# EAGLE design BusPirate-v3b-schamp (EAGLE 5.10)
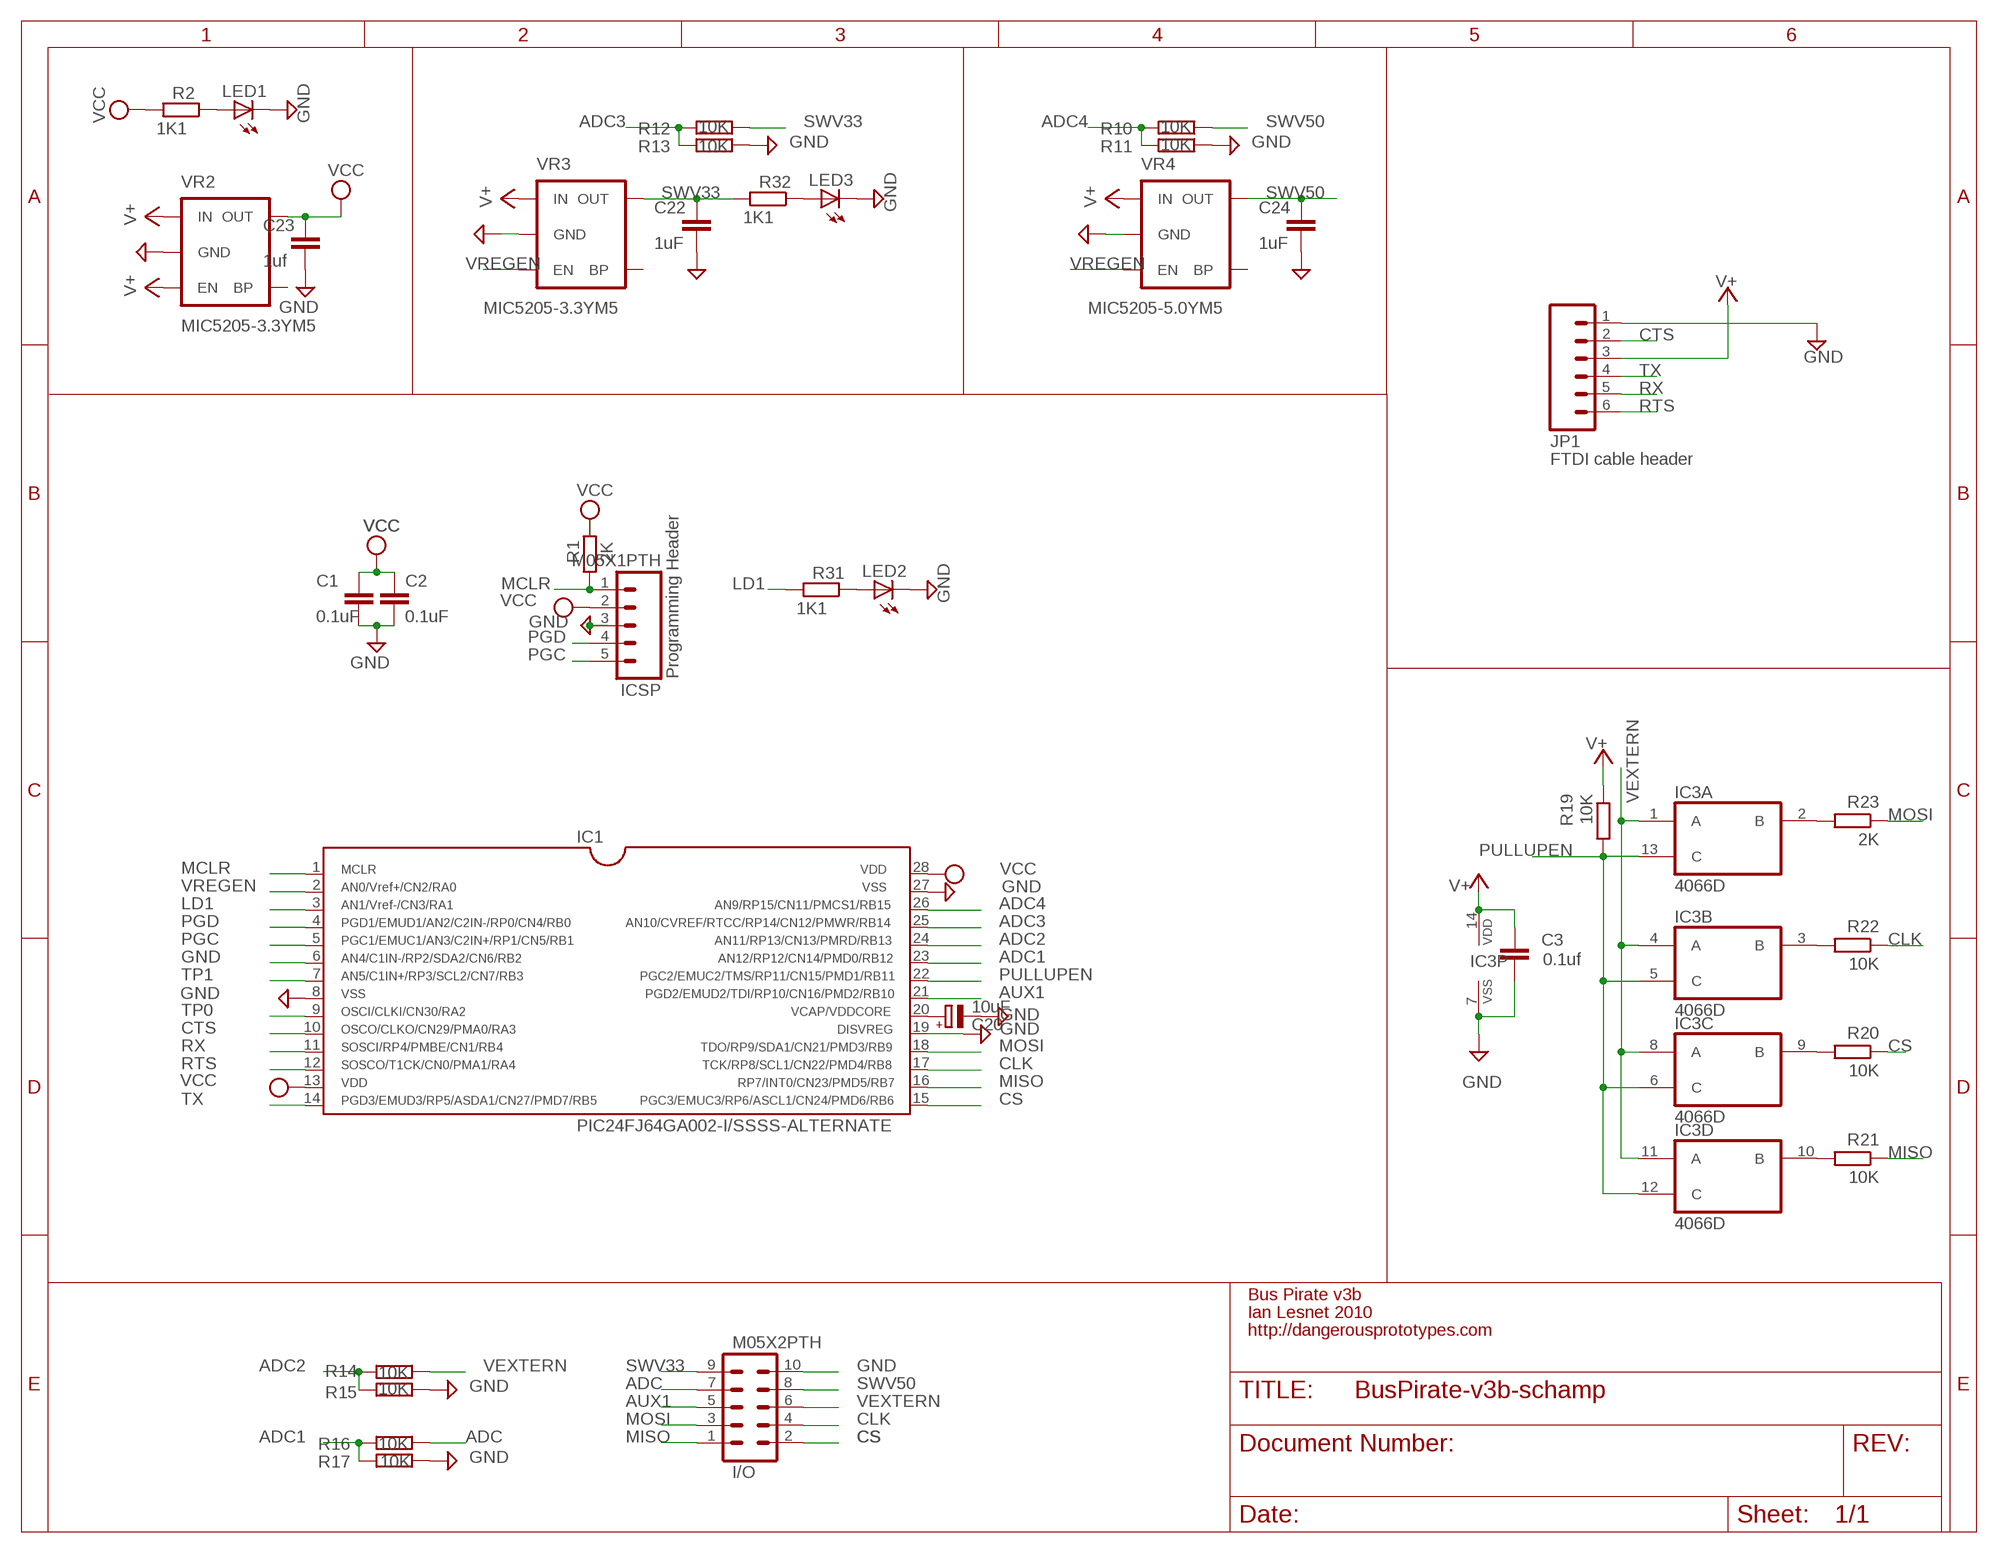
[diagram p0: schematic, sheet 1]

## Parts
C1  0.1uF  C-EUC0805  [C0805]
C2  0.1uF  C-EUC0805  [C0805]
C3  0.1uf  C-EUC0805  [C0805]
C20  10uF  CPOL-EUSMCA  [SMC_A]
C22  1uF  C-EUC0805  [C0805]
C23  1uf  C-EUC0805  [C0805]
C24  1uF  C-EUC0805  [C0805]
I/O  M05X2PTH  [AVR_ICSP]
IC1  PIC24FJ64GA002-I/SSSS-ALTERNATE  [SSOP28DB]
IC3  4066D  [SO14]
ICSP  M05X1PTH  M05LOCK_LONGPADS  [1X05_LOCK_LONGPADS]
JP1  M06LOCK_LONGPADS  [1X06_LOCK_LONGPADS]
LED1  LEDCHIP-LED0805  [CHIP-LED0805]
LED2  LEDCHIP-LED0805  [CHIP-LED0805]
LED3  LEDCHIP-LED0805  [CHIP-LED0805]
R1  2K  R-EU_R0805  [R0805]
R2  1K1  R-EU_M0805  [M0805]
R10  10K  R-EU_M0805  [M0805]
R11  10K  R-EU_M0805  [M0805]
R12  10K  R-EU_M0805  [M0805]
R13  10K  R-EU_M0805  [M0805]
R14  10K  R-EU_M0805  [M0805]
R15  10K  R-EU_M0805  [M0805]
R16  10K  R-EU_M0805  [M0805]
R17  10K  R-EU_M0805  [M0805]
R19  10K  R-EU_R0805  [R0805]
R20  10K  R-EU_R0805  [R0805]
R21  10K  R-EU_R0805  [R0805]
R22  10K  R-EU_R0805  [R0805]
R23  2K  R-EU_R0805  [R0805]
R31  1K1  R-EU_M0805  [M0805]
R32  1K1  R-EU_M0805  [M0805]
VR2  MIC5205-3.3YM5  V_REG_LDOSMD  [SOT23-5]
VR3  MIC5205-3.3YM5  V_REG_LDOSMD  [SOT23-5]
VR4  MIC5205-5.0YM5  V_REG_LDOSMD  [SOT23-5]

## Nets
ADC: I/O.7 R16.1
ADC1: IC1.23 R16.2 R17.2
ADC2: IC1.24 R14.2 R15.2
ADC3: IC1.25 R12.2 R13.2
ADC4: IC1.26 R10.2 R11.2
AUX1: I/O.5 IC1.21
CLK: I/O.4 IC1.17 R22.1
CS: I/O.2 IC1.15 R20.1
CTS: IC1.10 JP1.2
GND: C1.2 C2.2 C3.2 C20.- C22.2 C23.2 C24.2 I/O.10 IC1.6 IC1.8 IC1.19 IC1.27 IC3.7(P:VSS) ICSP.3 JP1.1 LED1.C LED2.C LED3.C R11.1 R13.1 R15.1 R17.1 VR2.2(GND) VR3.2(GND) VR4.2(GND)
LD1: IC1.3 R31.2
MCLR: IC1.1 ICSP.1 R1.1
MISO: I/O.1 IC1.16 R21.1
MOSI: I/O.3 IC1.18 R23.1
N$1: IC3.2(A:B) R23.2
N$2: IC3.3(B:B) R22.2
N$3: C20.+ IC1.20
N$4: IC3.10(D:B) R21.2
N$5: IC3.9(C:B) R20.2
N$6: LED2.A R31.1
N$7: LED1.A R2.1
N$18: LED3.A R32.1
PGC: IC1.5 ICSP.5
PGD: IC1.4 ICSP.4
PULLUPEN: IC1.22 IC3.5(B:C) IC3.6(C:C) IC3.12(D:C) IC3.13(A:C) R19.2
RTS: IC1.12 JP1.6
RX: IC1.11 JP1.5
SWV33: C22.1 I/O.9 R12.1 R32.2 VR3.5(OUT)
SWV50: C24.1 I/O.8 R10.1 VR4.5(OUT)
TP0: IC1.9
TP1: IC1.7
TX: IC1.14 JP1.4
V+: C3.1 IC3.14(P:VDD) JP1.3 R19.1 VR2.1(IN) VR2.3(EN) VR3.1(IN) VR4.1(IN)
VCC: C1.1 C2.1 C23.1 IC1.13 IC1.28 ICSP.2 R1.2 R2.2 VR2.5(OUT)
VEXTERN: I/O.6 IC3.1(A:A) IC3.4(B:A) IC3.8(C:A) IC3.11(D:A) R14.1
VREGEN: IC1.2 VR3.3(EN) VR4.3(EN)
Unconnected: VR2.4(BP) VR3.4(BP) VR4.4(BP)

## Notes on the sheet
- FTDI cable header
- Programming Header
- Bus Pirate v3b
- Ian Lesnet 2010
- http://dangerousprototypes.com

## Library data of the parts
C1-C3 C22-C24 = rcl:C-EU: CAPACITOR, European symbol
C20 = rcl:CPOL-EU: POLARIZED CAPACITOR, European symbol
I/O = SparkFun:M05X2: Header 5x2 Standard 10-pin dual row 0.1" header. Commonly used with AVR-ISP. Use with Spark Fun Electronics SKU: PRT-00778
IC1 = microchip-pic24:PIC24FJ64GA002-I/SS
IC3 = 40xx:4066: Quad bilateral ANALOG SWITCH
ICSP = SparkFun:M05: Header 5 Standard 5-pin 0.1" header. Use with straight break away headers (SKU : PRT-00116), right angle break away headers (PRT-00553), swiss pins (PRT-00743), machine pins (PRT-00117), and female headers (PRT-00115). Molex polarized connector foot print use with SKU : PRT-08230 with associated crimp pins and housings.
JP1 = SparkFun:M06: Header 6 Standard 6-pin 0.1" header. Use with straight break away headers (SKU : PRT-00116), right angle break away headers (PRT-00553), swiss pins (PRT-00743), machine pins (PRT-00117), and female headers (PRT-00115). Molex polarized connector foot print use with SKU : PRT-08094 with associated crimp pins and housings. NOTES ON THE VARIANTS LOCK and LOCK_LONGPADS... This footprint was designed to help hold the alignment of a through-hole component (i.e. 6-pin header) while soldering it into place. You may notice that each hole has been shifted either up or down by 0.005 of an inch from it's more standard position (which is a perfectly straight line). This slight alteration caused the pins (the squares in the middle) to touch the edges of the holes. Because they are alternating, it causes a "brace" to hold the component in place. 0.005 has proven to be the perfect amount of "off-center" position when using our standard breakaway headers. Although looks a little odd when you look at the bare footprint, once you have a header in there, the alteration is very hard to notice. Also, if you push a header all the way into place, it is covered up entirely on the bottom side. This idea of altering the position of holes to aid alignment will be further integrated into the Sparkfun Library for other footprints. It can help hold any component with 3 or more connection pins.
LED1-LED3 = led:LED: LED OSRAM: - CHIPLED LG R971, LG N971, LY N971, LG Q971, LY Q971, LO R971, LY R971 LH N974, LH R974 LS Q976, LO Q976, LY Q976 LO Q996 - Hyper CHIPLED LW Q18S LB Q993, LB Q99A, LB R99A - SideLED LS A670, LO A670, LY A670, LG A670, LP A670 LB A673, LV A673, LT A673, LW A673 LH A674 LY A675 LS A676, LA A676, LO A676, LY A676, LW A676 LS A679, LY A679, LG A679 - Hyper Micro SIDELED® LS Y876, LA Y876, LO Y876, LY Y876 LT Y87S - SmartLED LW L88C, LW L88S LB L89C, LB L89S, LG L890 LS L89K, LO L89K, LY L89K LS L896, LA L896, LO L896, LY L896 - TOPLED LS T670, LO T670, LY T670, LG T670, LP T670 LSG T670, LSP T670, LSY T670, LOP T670, LYG T670 LG T671, LOG T671, LSG T671 LB T673, LV T673, LT T673, LW T673 LH T674 LS T676, LA T676, LO T676, LY T676, LB T676, LH T676, LSB T676, LW T676 LB T67C, LV T67C, LT T67C, LS T67K, LO T67K, LY T67K, LW E67C LS E67B, LA E67B, LO E67B, LY E67B, LB E67C, LV E67C, LT E67C LW T67C LS T679, LY T679, LG T679 LS T770, LO T770, LY T770, LG T770, LP T770 LB T773, LV T773, LT T773, LW T773 LH T774 LS E675, LA E675, LY E675, LS T675 LS T776, LA T776, LO T776, LY T776, LB T776 LHGB T686 LT T68C, LB T68C - Hyper Mini TOPLED® LB M676 - Mini TOPLED Santana® LG M470 LS M47K, LO M47K, LY M47K Source: http://www.osram.convergy.de LUXEON: - LUMILED® LXK2-PW12-R00, LXK2-PW12-S00, LXK2-PW14-U00, LXK2-PW14-V00 LXK2-PM12-R00, LXK2-PM12-S00, LXK2-PM14-U00 LXK2-PE12-Q00, LXK2-PE12-R00, LXK2-PE12-S00, LXK2-PE14-T00, LXK2-PE14-U00 LXK2-PB12-K00, LXK2-PB12-L00, LXK2-PB12-M00, LXK2-PB14-N00, LXK2-PB14-P00, LXK2-PB14-Q00 LXK2-PR12-L00, LXK2-PR12-M00, LXK2-PR14-Q00, LXK2-PR14-R00 LXK2-PD12-Q00, LXK2-PD12-R00, LXK2-PD12-S00 LXK2-PH12-R00, LXK2-PH12-S00 LXK2-PL12-P00, LXK2-PL12-Q00, LXK2-PL12-R00 Source: www.luxeon.com KINGBRIGHT: KA-3528ASYC Source: www.kingbright.com
R1 R2 R19-R23 R31 R32 = rcl:R-EU_: RESISTOR, European symbol
R10-R17 = resistor:R-EU_: RESISTOR, European symbol
VR2-VR4 = SparkFun:V_REG_LDO: Voltage Regulator LDO Standard 150mA LDO voltage regulator in SOT-23 layout. Micrel part MIC5205. BP (by-pass) pin is used to lower output noise with 470pF cap.

## Board
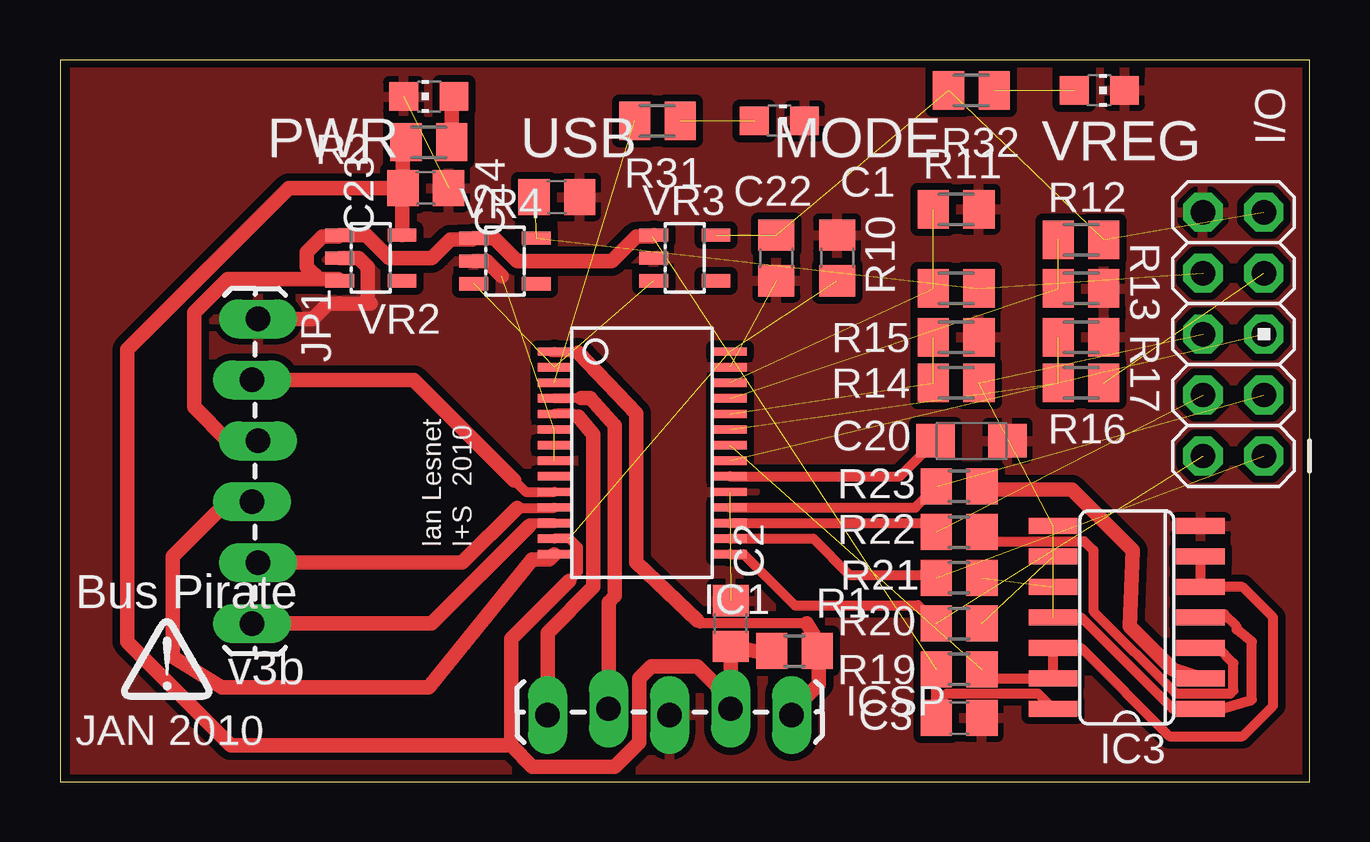
[diagram p1: board, top side]

Size 52.07 x 30.1 mm. Coordinates in mm from the lower left corner, seen from the top.
Outline: 0,30.1 0,0 52.07,0 52.07,30.1 0,30.1
Copper layers (1*16): Top 0.035mm / dielectric 1.5mm / Bottom 0.035mm
Design rules "SparkFun": minimum track width 8mil, minimum drill 20mil, track to track 8mil, track to pad 8mil, pad to pad 8mil, via to via 8mil, smd to smd 8mil, copper to edge 10mil, drill to drill 8mil, minimum pad ring 12mil, minimum via ring 10mil, stop-mask expansion 4mil, vias tented up to drill 25mil, thermal gap 10mil
tRestrict: area 12.1,10.8 to 13,10.9

### Footprints (pad centres in the part's own frame; a part is rotated, then mirrored left to right if it is on the bottom)
C0805 = smd 1.3 x 1.5: 1 -0.95,0; 2 0.95,0
SMC_A = smd 1.6 x 1.4: + -1.5,0; - 1.5,0
AVR_ICSP = drill 1.016 octagon: 1 -1.27,5.08; 2 1.27,5.08; 3 -1.27,2.54; 4 1.27,2.54; 5 -1.27,0; 6 1.27,0; 7 -1.27,-2.54; 8 1.27,-2.54; 9 -1.27,-5.08; 10 1.27,-5.08
SSOP28DB = smd 0.348 x 1.397: 1 -4.225,-3.656; 2 -3.575,-3.656; 3 -2.925,-3.656; 4 -2.275,-3.656; 5 -1.625,-3.656; 6 -0.975,-3.656; 7 -0.325,-3.656; 8 0.325,-3.656; 9 0.975,-3.656; 10 1.625,-3.656; 11 2.275,-3.656; 12 2.925,-3.656; 13 3.575,-3.656; 14 4.225,-3.656; 15 4.225,3.656; 16 3.575,3.656; 17 2.925,3.656; 18 2.275,3.656; 19 1.625,3.656; 20 0.975,3.656; 21 0.325,3.656; 22 -0.325,3.656; 23 -0.975,3.656; 24 -1.625,3.656; 25 -2.275,3.656; 26 -2.925,3.656; 27 -3.575,3.656; 28 -4.225,3.656
SO14 = smd 0.66 x 2.032: 1 -3.81,-3.073; 2 -2.54,-3.073; 3 -1.27,-3.073; 4 0,-3.073; 5 1.27,-3.073; 6 2.54,-3.073; 7 3.81,-3.073; 8 3.81,3.073; 9 2.54,3.073; 10 1.27,3.073; 11 0,3.073; 12 -1.27,3.073; 13 -2.54,3.073; 14 -3.81,3.073
1X05_LOCK_LONGPADS = drill 1.016 long: 1 0,0; 2 2.54,-0.254; 3 5.08,0; 4 7.62,-0.254; 5 10.16,0
1X06_LOCK_LONGPADS = drill 1.016 long: 1 0,0; 2 2.54,-0.254; 3 5.08,0; 4 7.62,-0.254; 5 10.16,0; 6 12.7,-0.254
CHIP-LED0805 = smd 1.2 x 1.2: A 0,-1.05; C 0,1.05
R0805 = smd 1.3 x 1.5: 1 -0.95,0; 2 0.95,0
M0805 = smd 1.3 x 1.6: 1 -0.95,0; 2 0.95,0
SOT23-5 = smd 0.55 x 1.2: 1 -0.95,-1.3; 2 0,-1.3; 3 0.95,-1.3; 4 0.95,1.3; 5 -0.95,1.3

### Placement (x,y rotation side)
C1  32.38,21.84 90 top
C2  27.94,6.6 90 top
C3  37.46,2.67 0 top
C20  37.97,14.22 0 top
C22  29.85,21.84 270 top
C23  15.24,24.76 0 top
C24  20.7,24.38 0 top
I/O  48.89,18.67 180 top
IC1  24.26,13.72 270 top
IC3  44.45,6.86 90 top
ICSP  30.48,2.79 180 top
JP1  8.26,19.3 270 top
LED1  15.37,28.57 90 top
LED2  29.97,27.56 270 top
LED3  43.31,28.83 270 top
R1  30.61,5.46 180 top
R2  15.37,26.67 180 top
R10  37.34,20.57 180 top
R11  37.34,23.88 180 top
R12  42.54,22.61 180 top
R13  42.54,20.57 180 top
R14  37.34,16.64 180 top
R15  37.34,18.54 180 top
R16  42.54,16.64 180 top
R17  42.54,18.54 180 top
R19  37.46,4.7 0 top
R20  37.46,6.6 0 top
R21  37.46,8.51 0 top
R22  37.46,10.41 0 top
R23  37.46,12.32 0 top
R31  24.89,27.56 180 top
R32  37.97,28.83 180 top
U$1  [DP-LOGO]  2.54,3.43 0 top
VR2  12.95,21.84 270 top
VR3  26.04,21.84 270 top
VR4  18.54,21.72 270 top

### Tracks (layer width: path | path; a pad name or v marks a point on that pad's centre or on a via)
ADC  (1 unrouted)
ADC1  (2 unrouted)
ADC2  (2 unrouted)
ADC3  (2 unrouted)
ADC4  (2 unrouted)
AUX1  (1 unrouted)
CLK  (1 unrouted)
  Top 0.406: IC1.17 36.14,10.79 R22.1
CS  (1 unrouted)
  Top 0.406: IC1.15 28.48,9.49 30.61,7.37 35.75,7.37 R20.1
CTS
  Top 0.406: IC1.10 19.41,12.09 18.92,12.57
  Top 0.61: 18.92,12.57 14.73,16.76 JP1.2
GND  (5 unrouted)
  Top 0.61: VR2.2 12.45,21.84 12.83,21.46 12.83,20.07 12.95,19.94 11.18,19.94 10.54,19.3 JP1.1 | VR4.2 17.78,21.72 18.42,21.08
  pour Top (isolate 0.305): 0.64,30.1 52.07,30.1 52.07,0.25 0.64,0.25
LD1  (1 unrouted)
MCLR
  Top 0.406: 31.12,6.6 26.67,6.6 26.54,6.73 | 21.59,17.91 20.51,17.91 IC1.1
  Top 0.61: ICSP.1 30.48,2.92 31.62,4.06 31.62,5.14 R1.1 31.56,5.91 31.12,6.6 | 26.54,6.73 24,9.14 24,15.37 21.59,17.91
MISO  (1 unrouted)
  Top 0.406: IC1.16 31.39,10.14 32.89,8.64 36.39,8.64 R21.1
MOSI  (1 unrouted)
  Top 0.406: IC1.18 35.64,11.44 R23.1
N$1
  Top 0.61: IC3.2 46.35,4.7 44.58,6.48 44.7,9.65 42.16,12.19 38.54,12.19 R23.2
N$2
  Top 0.406: IC3.3 48.26,5.59 48.89,4.95 48.89,3.81 48.77,3.68 46.48,3.68 43.05,7.11 43.05,9.65 42.67,10.03 38.8,10.03 R22.2
N$3
  Top 0.406: IC1.20 34.99,12.74 C20.+
N$4  (1 unrouted)
N$5  (1 unrouted)
N$6  (1 unrouted)
N$7
  Top 0.61: R2.1 16.32,28.47 LED1.A
N$18  (1 unrouted)
PGC
  Top 0.406: 21.59,15.24 21.34,15.37 20.75,15.37 IC1.5
  Top 0.61: ICSP.5 20.32,6.22 22.23,8.13 22.23,14.48 21.59,15.24
PGD
  Top 0.406: IC1.4 21.33,15.99 21.72,16
  Top 0.61: 21.72,16 22.1,16 23.11,14.86 23.11,7.75 22.86,7.49 ICSP.4
PULLUPEN  (1 unrouted)
  Top 0.406: R19.2 38.8,4.32 IC3.13 IC3.12 42.54,5.59 46.23,1.9 49.28,1.9 50.55,3.18 50.55,6.86 49.28,8.13 IC3.5 IC3.6
RTS
  Top 0.406: IC1.12 19.55,10.79 19.56,10.67
  Top 0.61: 19.56,10.67 15.49,6.6 JP1.6
RX
  Top 0.406: 19.05,11.43 20.59,11.43 IC1.11
  Top 0.61: JP1.5 16.76,9.14 19.05,11.43
SWV33  (4 unrouted)
SWV50  (3 unrouted)
TX
  Top 0.61: JP1.4 6.98,11.68 4.7,9.4 4.7,5.21 6.73,3.94 15.37,3.94 19.69,9.27 20.38,9.27 IC1.14
V+  (1 unrouted)
  Top 0.406: R19.1 C3.1 36.52,3.24 36.96,3.68 40.74,3.68 IC3.14
  Top 0.61: JP1.3 6.98,14.22 5.59,15.62 5.59,19.56 6.98,20.96 10.79,20.96 | VR2.3 11.59,20.96 10.79,20.96 | 10.79,20.96 10.29,21.46 10.29,22.1 10.92,22.73 11.59,22.73 VR2.1 12.77,22.79 13.72,21.84 15.49,21.84 16.26,22.61 17.18,22.61 VR4.1 18.1,22.67 19.05,21.72 22.99,21.72 24,22.73 24.67,22.73 VR3.1
VCC  (2 unrouted)
  Top 0.406: IC1.13 21.23,10.14 21.59,9.78 21.59,8.76 21.21,8.38
  Top 0.61: 21.21,8.38 18.8,5.97 18.8,1.52 | 18.8,1.52 19.69,0.63 23.11,0.63 24.13,1.65 24.13,4.32 24.64,4.83 26.54,4.83 27.94,3.43 | 27.94,3.43 ICSP.2 | 27.94,3.43 C2.1 29.21,5.4 R1.2 | 18.8,1.52 7.11,1.52 2.79,5.84 2.79,18.03 9.53,24.76 C23.1 | VR2.5 14.25,24.73 C23.1 | C23.1 14.29,26.54 R2.2
VEXTERN  (3 unrouted)
  Top 0.406: IC3.4 47.65,6.98 48.51,6.98 49.02,6.48 49.02,6.35 49.66,5.84 49.66,3.43 48.39,3.05 IC3.1 46.35,3.05 42.54,6.86 IC3.11
VREGEN  (2 unrouted)

### Text on the board
tNames: PWR | USB | MODE | VREG | 2010 | Ian Lesnet | I+S | Bus Pirate | v3b | JAN 2010
bNames: PWR | USB | MODE | VREG | GND | +3.3 | BPv3 | +5V | ADC | DangerousPrototypes.com | Vpu | AUX | CLK | MOSI | Fulfillment by | CS | MISO | Seeed Studio | www.seeedstudio.com | MCLR | +3.3V | GND | PGD | PGC
Reference: GND | +3v | +5v | ADC | Vpu | AUX1 | CLK | MOSI | USB | CS | MISO | I/O header | MCLR | +3.3V | GND | DATA | CLOCK | Bus Pirate v3b | Ian Lesnet | Programming Header | CC-0 | April 2010 | http://dangerousprototypes.com